# EAGLE design 4069-filter (EAGLE 7.7.0)
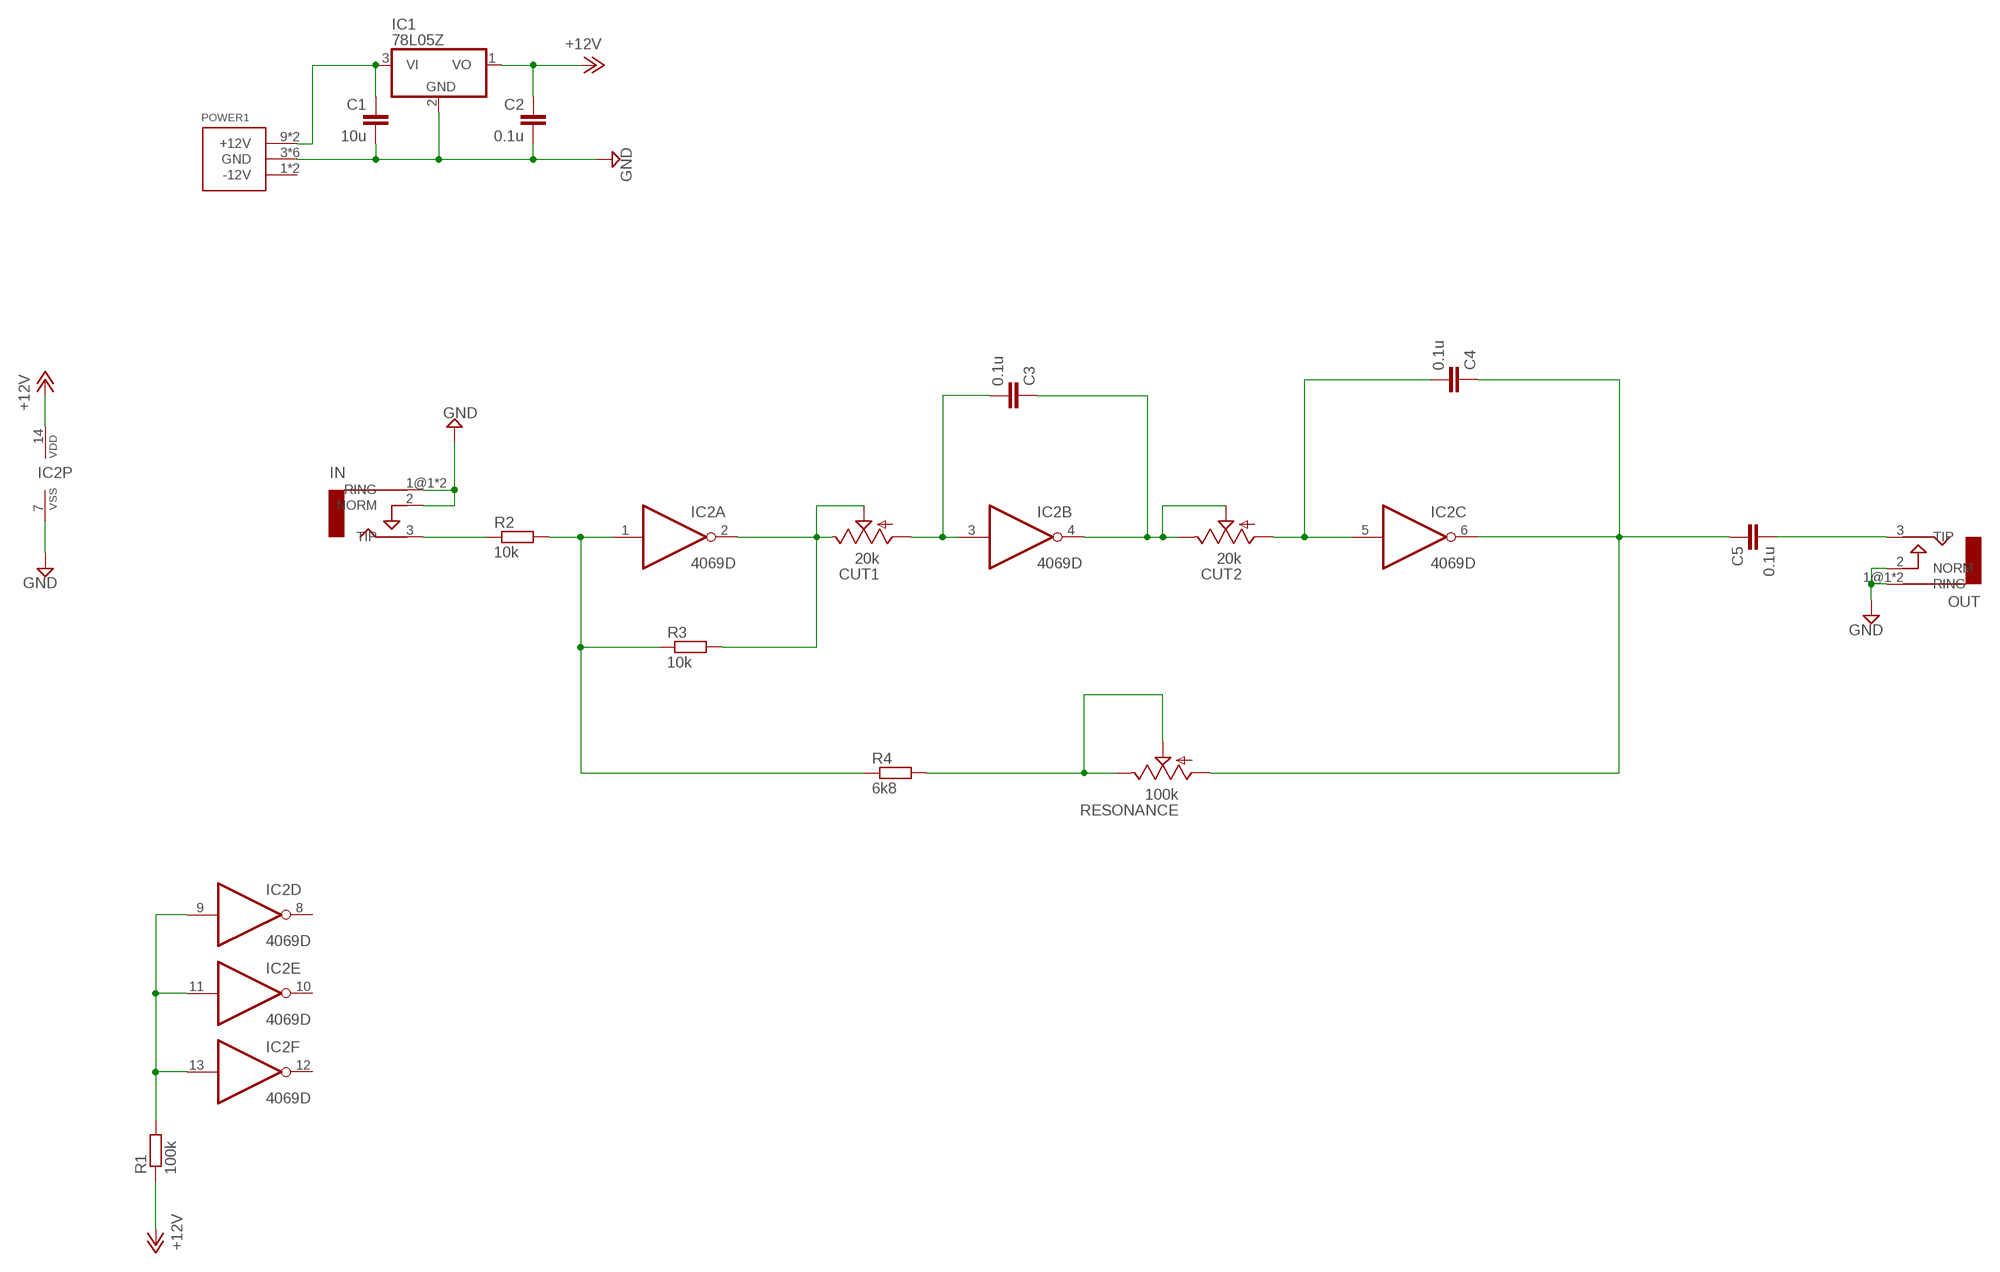
[diagram p0: schematic, sheet 1]

## Parts
C1  10u  C-EUC0805  [C0805]
C2  0.1u  C-EUC0805  [C0805]
C3  0.1u  C-EUC0805  [C0805]
C4  0.1u  C-EUC0805  [C0805]
C5  0.1u  C-EUC0805  [C0805]
CUT1  20k  9MM_SNAP-IN_POT_  [9MM_SNAP-IN_POT]
CUT2  20k  9MM_SNAP-IN_POT_  [9MM_SNAP-IN_POT]
IC1  78L05Z  [TO92]
IC2  4069D  [SO14]
IN  AUDIO-JACKERTHENVAR  [ERTHENVAR-JACK]
OUT  AUDIO-JACKERTHENVAR  [ERTHENVAR-JACK]
POWER1  POWER_SIMPLE10  [POWER_10]
R1  100k  R-EU_R0805  [R0805]
R2  10k  R-EU_R0805  [R0805]
R3  10k  R-EU_R0805  [R0805]
R4  6k8  R-EU_R0805  [R0805]
RESONANCE  100k  9MM_SNAP-IN_POT_  [9MM_SNAP-IN_POT]

## Nets
+12V: C2.1 IC1.1(VO) IC2.14(P:VDD) R1.1
FILTER_OUT1: C3.1 CUT2.2(S) CUT2.3(E) IC2.4(B:O)
FILTER_OUT2: C4.1 C5.1 IC2.6(C:O) RESONANCE.1(A)
GND: C1.2 C2.2 IC1.2(GND) IC2.7(P:VSS) IN.1@1(RING) IN.1@2(RING) IN.2(NORM) OUT.1@1(RING) OUT.1@2(RING) OUT.2(NORM) POWER1.3(GND) POWER1.4(GND) POWER1.5(GND) POWER1.6(GND) POWER1.7(GND) POWER1.8(GND)
IN: IN.3(TIP) R2.1
N$1: C5.2 OUT.3(TIP)
N$2: IC2.9(D:I) IC2.11(E:I) IC2.13(F:I) R1.2
N$3: C1.1 IC1.3(VI) POWER1.9(+12V) POWER1.10(+12V)
N$4: C3.2 CUT1.1(A) IC2.3(B:I)
N$5: C4.2 CUT2.1(A) IC2.5(C:I)
N$6: R4.2 RESONANCE.2(S) RESONANCE.3(E)
N$21: CUT1.2(S) CUT1.3(E) IC2.2(A:O) R3.2
N$22: IC2.1(A:I) R2.2 R3.1 R4.1
Unconnected: IC2.8(D:O) IC2.10(E:O) IC2.12(F:O) POWER1.1(-12V) POWER1.2(-12V)

## Library data of the parts
C1-C5 = rcl:C-EU: CAPACITOR, European symbol
CUT1 CUT2 RESONANCE = MusicThingModular:9MM_SNAP-IN_POT: 9mm vertical snap-in pot, Alpha / Panasonic style
IC1 = linear:78*: Positive VOLTAGE REGULATOR Source: http://cache.national.com/ds/LM/LM78L05.pdf http://www.fairchildsemi.com/ds/LM/LM7805.pdf
IC2 = 40xx:4069: Hex INVERTER
IN OUT = erthenvar:AUDIO-JACK: Switching Mono 3.5mm Audio Jack from Erthenvar.
POWER1 = eurorack:POWER_SIMPLE
R1-R4 = rcl:R-EU_: RESISTOR, European symbol

## Board
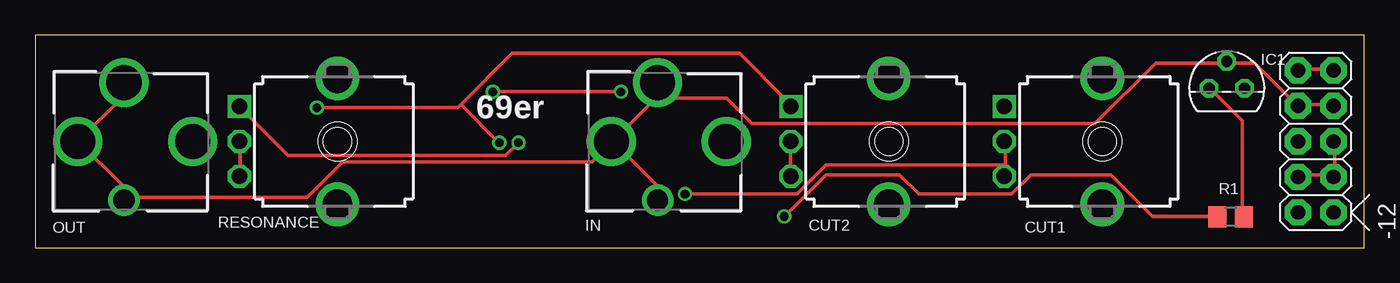
[diagram p1: board, top side]
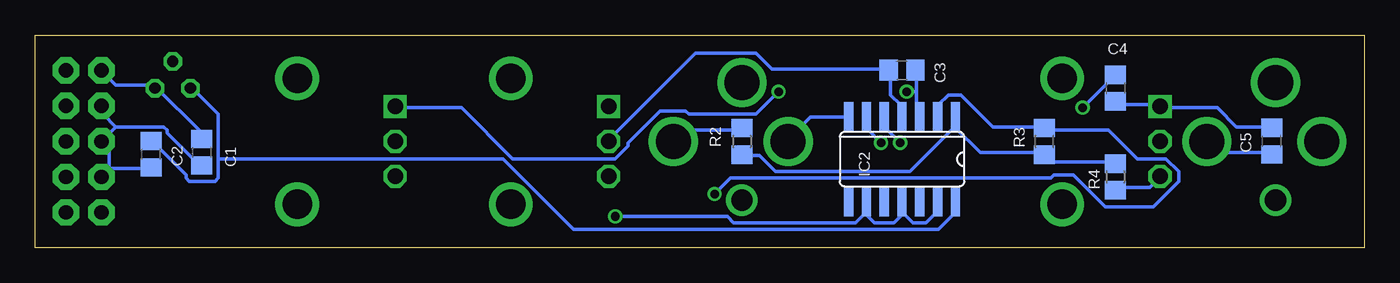
[diagram p2: board, bottom side, seen from below]

Size 94.92 x 15.23 mm. Coordinates in mm from the lower left corner, seen from the top.
Outline: 0,0 94.92,0 94.92,15.23 0,15.23 0,0
Copper layers (1*16): Top 0.035mm / dielectric 1.5mm / Bottom 0.035mm
Design rules "default": minimum track width 10mil, minimum drill 24mil, track to track 8mil, track to pad 8mil, pad to pad 8mil, via to via 8mil, smd to smd 8mil, copper to edge 40mil, drill to drill 8mil, minimum pad ring 10mil, minimum via ring 8mil, stop-mask expansion 4mil, vias tented up to drill 0mil, thermal gap 10mil

### Footprints (pad centres in the part's own frame; a part is rotated, then mirrored left to right if it is on the bottom)
C0805 = smd 1.3 x 1.5: 1 -0.95,0; 2 0.95,0
9MM_SNAP-IN_POT = drill 1.1 square: 1 -2.5,-7 | drill 1.1 octagon: 2 0,-7; 3 2.5,-7 | drill 2.1 pad 2.794: CHASSIS1 -4.5,0; CHASSIS2 4.5,0
TO92 = drill 0.813 octagon: 1 -1.27,0; 2 0,1.905; 3 1.27,0
SO14 = smd 0.66 x 2.032: 1 -3.81,-3.073; 2 -2.54,-3.073; 3 -1.27,-3.073; 4 0,-3.073; 5 1.27,-3.073; 6 2.54,-3.073; 7 3.81,-3.073; 8 3.81,3.073; 9 2.54,3.073; 10 1.27,3.073; 11 0,3.073; 12 -1.27,3.073; 13 -2.54,3.073; 14 -3.81,3.073
ERTHENVAR-JACK = drill 2.5: 1@1 -4.2,0; 2 0,-3.3; 3 0,4.9 | drill 1.5: 1@2 4.2,0
POWER_10 = drill 1.016 pad 1.88 octagon: 1 -5.08,-1.27; 2 -5.08,1.27; 3 -2.54,-1.27; 4 -2.54,1.27; 5 0,-1.27; 6 0,1.27; 7 2.54,-1.27; 8 2.54,1.27; 9 5.08,-1.27; 10 5.08,1.27
R0805 = smd 1.3 x 1.5: 1 -0.95,0; 2 0.95,0

### Placement (x,y rotation side)
C1  83.01,6.85 270 bottom
C2  86.63,6.71 270 bottom
C3  33.02,12.7 0 bottom
C4  17.78,11.43 90 bottom
C5  6.63,7.64 270 bottom
CUT1  76.2,7.62 270 top
CUT2  60.96,7.62 270 top
IC1  85.09,11.43 0 top
IC2  33.02,6.35 180 bottom
IN  44.45,7.62 270 top
OUT  6.35,7.62 270 top
POWER1  91.44,7.62 90 top
R1  85.36,2.21 180 top
R2  44.45,7.62 270 bottom
R3  22.86,7.62 90 bottom
R4  17.78,5.08 270 bottom
RESONANCE  21.59,7.62 270 top

### Tracks (layer width: path | path; a pad name or v marks a point on that pad's centre or on a via)
+12V
  Top 0.254: R1.1 86.18,2.26 86.18,9.12 83.9,11.41 IC1.1
  Bottom 0.254: 81.84,6.37 81.84,9.58 83.67,11.41 IC1.1 | 81.84,6.37 81.84,5 82.07,4.78 83.9,4.78 84.12,5 84.12,5.23 86.41,7.52 C2.1 | 81.84,6.37 61.49,6.37 56.46,1.35 30.4,1.35 29.26,2.49 29.26,3.17 IC2.14
FILTER_OUT1
  Top 0.254: CUT2.3 53.95,5.23 53.95,7.52 CUT2.2
  Bottom 0.254: IC2.4 33.15,9.58 33.15,10.26 33.83,10.95 33.83,12.55 C3.1 34.06,12.78 42.29,12.78 43.43,13.92 47.78,13.92 53.95,7.75 CUT2.2
FILTER_OUT2  (via drill 0.61)
  Top 0.254: v34.52,7.52 33.6,6.6 18.06,6.6 14.63,10.03 RESONANCE.1
  Bottom 0.254: C5.1 6.86,8.66 9.14,8.66 10.52,10.03 14.4,10.03 RESONANCE.1 14.63,10.26 17.6,10.26 C4.1 | v34.52,7.52 35.43,8.43 35.43,9.35 IC2.6
GND
  Top 0.254: OUT.1@1 6.17,11.63 6.17,10.72 3.2,7.75 OUT.2 3.2,7.52 6.17,4.55 6.17,3.63 OUT.1@2 6.4,3.63 19.43,3.63 21.95,6.15 39.78,6.15 41.15,7.52 IN.2 | POWER1.7 92.58,10.26 90.3,10.26 POWER1.8 87.1,13.23 85.27,13.23 IC1.2 85.04,13.23 80.01,13.23 75.67,8.89 51.21,8.89 49.38,10.72 44.35,10.72 | POWER1.5 92.81,7.52 92.81,5.23 POWER1.3 92.58,5.23 90.3,5.23 POWER1.4 | IN.1@2 44.35,3.63 44.35,4.55 41.38,7.52 IN.2 | 44.35,10.72 44.35,11.63 IN.1@1 44.35,10.72 | 44.35,10.72 41.38,7.75 IN.2
  Bottom 0.254: 89.61,5.69 86.64,5.69 C2.2 | 89.61,5.69 90.07,5.23 POWER1.4 89.61,5.69 | 89.15,8.66 85.72,8.66 85.5,8.43 85.5,8.2 83.21,5.92 C1.2 | 89.15,8.66 90.07,7.75 POWER1.6 89.61,7.06 89.61,5.69 | 89.15,8.66 90.07,9.58 90.07,10.03 POWER1.8 | IC2.7 37.03,9.35 39.55,9.35 41.15,7.75 IN.2
IN
  Bottom 0.254: R2.1 44.58,8.43 48.46,8.43 49.15,7.75 IN.3
N$1
  Bottom 0.254: C5.2 6.86,6.83 10.52,6.83 11.2,7.52 OUT.3
N$2  (via drill 0.61)
  Top 0.254: v53.49,2.26 56.46,5.23 61.72,5.23 63.09,3.86 69.72,3.86 71.09,5.23 76.81,5.23 79.78,2.26 84.35,2.26 R1.2
  Bottom 0.254: 32.92,2.49 32.23,1.8 31.32,1.8 30.63,2.49 30.63,3.17 IC2.13 | 32.92,2.49 32.92,3.17 IC2.11 32.92,2.49 | v53.49,2.26 45.49,2.26 45.03,1.8 36.35,1.8 35.66,2.49 | 35.66,2.49 35.66,3.17 IC2.9 35.66,2.49 | 32.92,2.49 33.6,1.8 34.98,1.8 35.66,2.49
N$3
  Top 0.254: POWER1.10 90.3,12.78 92.58,12.78 POWER1.9
  Bottom 0.254: C1.1 83.21,7.98 83.21,8.43 86.18,11.41 IC1.3 86.41,11.63 89.15,11.63 90.07,12.55 POWER1.10
N$4  (via drill 0.61)
  Top 0.254: v41.83,11.18 v32.69,11.18
  Bottom 0.254: 32,11.18 32,9.8 31.77,9.58 IC2.3 | 32,11.18 32,12.55 C3.2 | v32.69,11.18 32,11.18 | v41.83,11.18 43.43,9.58 48.23,9.58 48.46,9.8 50.29,9.8 52.58,7.52 52.58,7.29 53.49,6.37 60.81,6.37 64.47,10.03 69.04,10.03 CUT1.1
N$5  (via drill 0.61)
  Top 0.254: v20.12,10.03 30.18,10.03 30.4,10.26 | 30.4,10.26 34.06,13.92 50.29,13.92 53.95,10.26 CUT2.1 | 30.4,10.26 v33.15,7.52
  Bottom 0.254: v20.12,10.03 17.83,12.32 C4.2 | IC2.5 34.29,8.66 v33.15,7.52
N$6
  Top 0.254: RESONANCE.2 14.63,7.52 14.63,5.23 RESONANCE.3
  Bottom 0.254: R4.2 17.6,4.32 15.32,4.32 14.63,5 RESONANCE.3
N$21  (via drill 0.61)
  Top 0.254: 69.27,5.92 69.27,7.52 CUT1.2 | 69.27,5.92 69.27,5.23 CUT1.3 69.27,5.92 | 69.27,5.92 56.46,5.92 54.41,3.86 v46.41,3.86
  Bottom 0.254: IC2.2 30.4,9.58 30.4,10.26 29.72,10.95 28.8,10.95 26.52,8.66 22.86,8.66 R3.2 22.86,8.43 18.29,8.43 16.23,6.37 14.17,6.37 13.26,5.46 13.26,4.78 15.09,2.95 18.52,2.95 20.8,5.23 22.17,5.23 22.4,5 45.26,5 v46.41,3.86
N$22
  Bottom 0.254: R4.1 17.83,6.15 22.4,6.15 22.86,6.6 R3.1 22.86,6.83 27.43,6.83 29.26,8.66 | 29.26,8.66 32.46,5.46 42.06,5.46 43.2,6.6 44.35,6.6 R2.2 | 29.26,8.66 29.26,9.35 IC2.1 29.26,8.66

### Text on the board
tNames: 69er